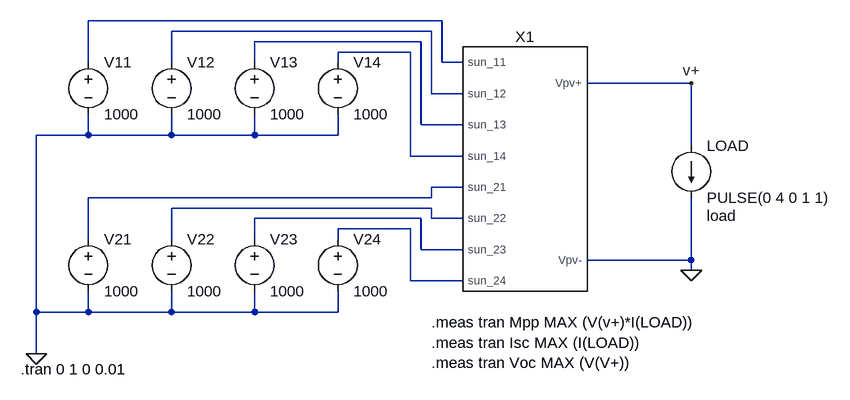
[diagram p0: schematic test1_pannello.asc]
test1_pannello.asc, the LTspice schematic file:
Version 4
SHEET 1 880 680
WIRE -48 -112 -592 -112
WIRE -64 -96 -464 -96
WIRE -80 -80 -336 -80
WIRE -96 -64 -208 -64
WIRE -592 -48 -592 -112
WIRE -464 -48 -464 -96
WIRE -336 -48 -336 -80
WIRE -208 -48 -208 -64
WIRE -48 -48 -48 -112
WIRE -16 -48 -48 -48
WIRE 336 -16 176 -16
WIRE -64 0 -64 -96
WIRE -16 0 -64 0
WIRE -80 48 -80 -80
WIRE -16 48 -80 48
WIRE -592 64 -592 32
WIRE -592 64 -672 64
WIRE -464 64 -464 32
WIRE -464 64 -592 64
WIRE -336 64 -336 32
WIRE -336 64 -464 64
WIRE -208 64 -208 32
WIRE -208 64 -336 64
WIRE 336 80 336 -16
WIRE -96 96 -96 -64
WIRE -16 96 -96 96
WIRE -16 144 -64 144
WIRE -64 160 -64 144
WIRE -64 160 -592 160
WIRE -64 176 -464 176
WIRE -80 192 -336 192
WIRE -64 192 -64 176
WIRE -16 192 -64 192
WIRE -96 208 -208 208
WIRE -592 224 -592 160
WIRE -464 224 -464 176
WIRE -336 224 -336 192
WIRE -208 224 -208 208
WIRE -80 240 -80 192
WIRE -16 240 -80 240
WIRE 336 256 336 160
WIRE 336 256 176 256
WIRE 336 272 336 256
WIRE -96 288 -96 208
WIRE -16 288 -96 288
WIRE -672 336 -672 64
WIRE -592 336 -592 304
WIRE -592 336 -672 336
WIRE -464 336 -464 304
WIRE -464 336 -592 336
WIRE -336 336 -336 304
WIRE -336 336 -464 336
WIRE -208 336 -208 304
WIRE -208 336 -336 336
WIRE -672 400 -672 336
FLAG -672 400 0
FLAG 336 272 0
FLAG 336 -16 v+
SYMBOL current 336 80 R0
WINDOW 123 0 0 Left 0
WINDOW 39 24 108 Left 2
SYMATTR SpiceLine load
SYMATTR InstName LOAD
SYMATTR Value PULSE(0 4 0 1 1)
SYMBOL voltage -592 -64 R0
SYMATTR InstName V11
SYMATTR Value 1000
SYMBOL voltage -464 -64 R0
SYMATTR InstName V12
SYMATTR Value 1000
SYMBOL voltage -336 -64 R0
SYMATTR InstName V13
SYMATTR Value 1000
SYMBOL voltage -208 -64 R0
WINDOW 123 0 0 Left 0
WINDOW 39 0 0 Left 0
SYMATTR InstName V14
SYMATTR Value 1000
SYMBOL voltage -592 208 R0
SYMATTR InstName V21
SYMATTR Value 1000
SYMBOL voltage -464 208 R0
SYMATTR InstName V22
SYMATTR Value 1000
SYMBOL voltage -336 208 R0
SYMATTR InstName V23
SYMATTR Value 1000
SYMBOL voltage -208 208 R0
WINDOW 123 0 0 Left 0
WINDOW 39 0 0 Left 0
SYMATTR InstName V24
SYMATTR Value 1000
SYMBOL pannello_40Celle_v1 80 64 R0
SYMATTR InstName X1
TEXT -696 424 Left 2 !.tran 0 1 0 0.01
TEXT -64 352 Left 2 !.meas tran Mpp MAX (V(v+)*I(LOAD))\n.meas tran Isc MAX (I(LOAD))\n.meas tran Voc MAX (V(V+))

The netlist it stands for:
* test1_pannello.asc
I§LOAD v+ 0 PULSE(0 4 0 1 1) load
V11 N001 0 1000
V12 N002 0 1000
V13 N003 0 1000
V14 N004 0 1000
V21 N005 0 1000
V22 N006 0 1000
V23 N007 0 1000
V24 N008 0 1000
XX1 N001 N002 N003 N004 N005 N006 N007 N008 v+ 0 pannello_40Celle_v1  ; pins sun_11 sun_12 sun_13 sun_14 sun_21 sun_22 sun_23 sun_24 Vpv+ Vpv-
.tran 0 1 0 0.01
.meas tran Mpp MAX (V(v+)*I(LOAD))
.meas tran Isc MAX (I(LOAD))
.meas tran Voc MAX (V(V+))
.backanno
.end